# Altium project Test_Board.PrjPcb
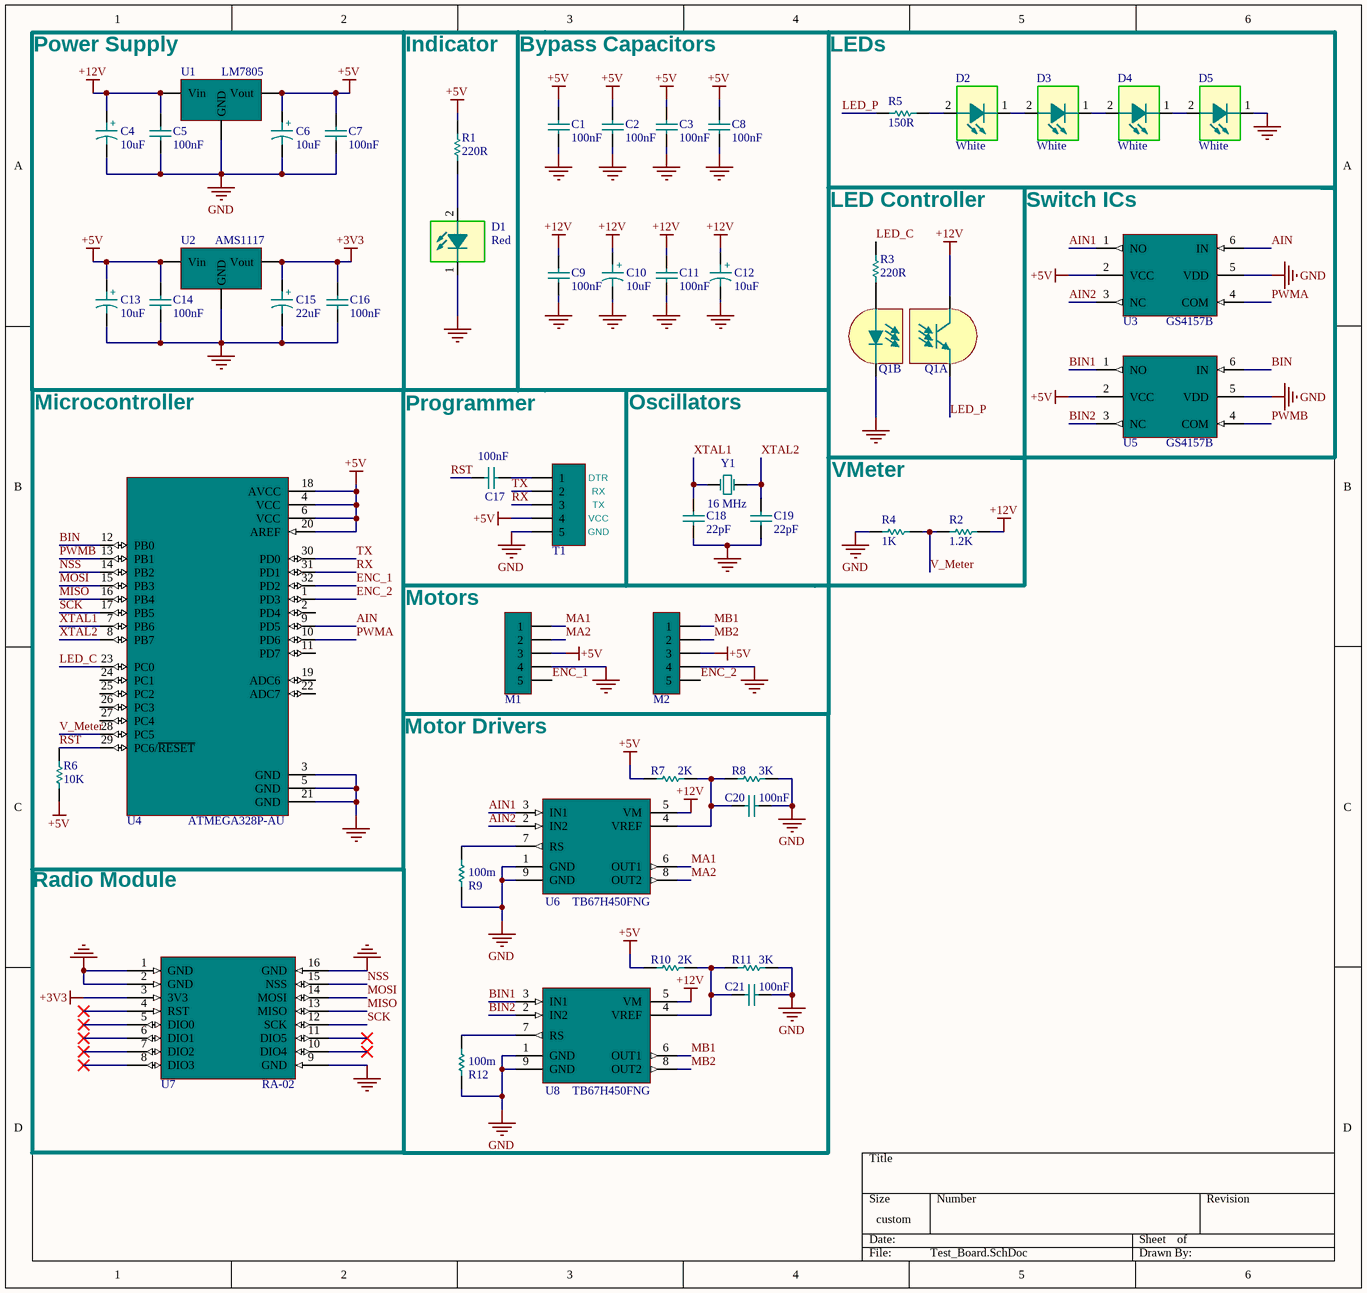
[diagram p0: Test_Board.SchDoc]
1 sheet, 51 parts. Net scope: global (net labels, ports and power ports of the same name join across sheets).
Board file: Test_Board.PcbDoc

## Sheet Test_Board.SchDoc
size 255 x 241 mm; SheetNumber: 1; SheetTotal: 1

### Parts
C1  Val-1: 100nF  [CAP 1206]  (hidden comment: Cap)
C2  Val-1: 100nF  [CAP 1206]  (hidden comment: Cap)
C3  Val-1: 100nF  [CAP 1206]  (hidden comment: Cap)
C4  Val-1: 10uF  [CAP Tantalum Size B]  (hidden comment: Cap BiPolar)
C5  Val-1: 100nF  [CAP 1206]  (hidden comment: Cap)
C6  Val-1: 10uF  [CAP Tantalum Size B]  (hidden comment: Cap BiPolar)
C7  Val-1: 100nF  [CAP 1206]  (hidden comment: Cap)
C8  Val-1: 100nF  [CAP 1206]  (hidden comment: Cap)
C9  Val-1: 100nF  [CAP 1206]  (hidden comment: Cap)
C10  Val-1: 10uF  [CAP Tantalum Size B]  (hidden comment: Cap BiPolar)
C11  Val-1: 100nF  [CAP 1206]  (hidden comment: Cap)
C12  Val-1: 10uF  [CAP Tantalum Size B]  (hidden comment: Cap BiPolar)
C13  Val-1: 10uF  [CAP Tantalum Size B]  (hidden comment: Cap BiPolar)
C14  Val-1: 100nF  [CAP 1206]  (hidden comment: Cap)
C15  Val-1: 22uF  [CAP Tantalum Size B]  (hidden comment: Cap BiPolar)
C16  Val-1: 100nF  [CAP 1206]  (hidden comment: Cap)
C17  Val-1: 100nF  [CAP 1206]  (hidden comment: Cap)
C18  Val-2: 22pF  [CAP 1206]  (hidden comment: Cap)
C19  Val-2: 22pF  [CAP 1206]  (hidden comment: Cap)
C20  Val-1: 100nF  [CAP 1206]  (hidden comment: Cap)
C21  Val-1: 100nF  [CAP 1206]  (hidden comment: Cap)
D1  Color-2: Red  [LED 1206]  (hidden comment: LED)
D2  Color-4: White  [LED 3528]  (hidden comment: LED)
D3  Color-4: White  [LED 3528]  (hidden comment: LED)
D4  Color-4: White  [LED 3528]  (hidden comment: LED)
D5  Color-4: White  [LED 3528]  (hidden comment: LED)
M1  Motor  [Motor]  (value not drawn)
M2  Motor  [Motor]  (value not drawn)
Q1  PC817  [PC817]  (value not drawn)  (parts A,B of 2)
R1  Val-3: 220R  [RES 1206]  (hidden comment: Resistor)
R2  Val-12: 1.2K  [RES 1206]  (hidden comment: Resistor)
R3  Val-3: 220R  [RES 1206]  (hidden comment: Resistor)
R4  Val-1: 1K  [RES 1206]  (hidden comment: Resistor)
R5  Val-8: 150R  [RES 1206]  (hidden comment: Resistor)
R6  Val-2: 10K  [RES 1206]  (hidden comment: Resistor)
R7  Val-11: 2K  [RES 1206]  (hidden comment: Resistor)
R8  Val-10: 3K  [RES 1206]  (hidden comment: Resistor)
R9  Val-9: 100m  [RES 1206]  (hidden comment: Resistor)
R10  Val-11: 2K  [RES 1206]  (hidden comment: Resistor)
R11  Val-10: 3K  [RES 1206]  (hidden comment: Resistor)
R12  Val-9: 100m  [RES 1206]  (hidden comment: Resistor)
T1  5 Pin Socket  [MO Header 5]  (value not drawn)
U1  LM7805  [7805 SMD]
U2  AMS1117  [AMS1117]
U3  GS4157B  [GS4157B]
U4  ATMEGA328P-AU  [ATmega328]
U5  GS4157B  [GS4157B]
U6  TB67H450FNG  [TB67H450FNG]
U7  RA-02  [RA-02]
U8  TB67H450FNG  [TB67H450FNG]
Y1  Val-2: 16 MHz  [Crystal-5032]  (hidden comment: XTAL)

### Blocks framed on the sheet
Power Supply: C4-C7 C13-C16 U1 U2

### Nets
+3V3: C15.1 C16.1 U2.2(Vout) U7.3(3V3)
+5V: C1.1 C2.1 C3.1 C6.1 C7.1 C8.1 C13.1 C14.1 M1.3 M2.3 R1.2 R6.2 R7.2 R10.2 T1.4 U1.3(Vout) U2.3(Vin) U3.2(VCC) U4.4(VCC) U4.6(VCC) U4.18(AVCC) U4.20(AREF) U5.2(VCC)
+12V: C4.1 C5.1 C9.1 C10.1 C11.1 C12.1 Q1.4(C) R2.2 U1.1(Vin) U6.5(VM) U8.5(VM)
GND: C1.2 C2.2 C3.2 C4.2 C5.2 C6.2 C7.2 C8.2 C9.2 C10.2 C11.2 C12.2 C13.2 C14.2 C15.2 C16.2 C18.1 C19.1 C20.2 C21.2 D1.1 D5.1 M1.4 M2.4 Q1.2(K) R4.1 R8.1 R9.1 R11.1 R12.1 T1.5 U1.2(GND) U2.1(GND) U3.5(VDD) U4.3(GND) U4.5(GND) U4.21(GND) U5.5(VDD) U6.1(GND) U6.9(GND) U7.1(GND) U7.2(GND) U7.9(GND) U7.16(GND) U8.1(GND) U8.9(GND)
AIN: U3.6(IN) U4.9(PD5)
AIN1: U3.1(NO) U6.3(IN1)
AIN2: U3.3(NC) U6.2(IN2)
BIN: U4.12(PB0) U5.6(IN)
BIN1: U5.1(NO) U8.3(IN1)
BIN2: U5.3(NC) U8.2(IN2)
ENC_1: M1.5 U4.32(PD2)
ENC_2: M2.5 U4.1(PD3)
LED_C: R3.2 U4.23(PC0)
LED_P: Q1.3(E) R5.2
MA1: M1.1 U6.6(OUT1)
MA2: M1.2 U6.8(OUT2)
MB1: M2.1 U8.6(OUT1)
MB2: M2.2 U8.8(OUT2)
MISO: U4.16(PB4) U7.13(MISO)
MOSI: U4.15(PB3) U7.14(MOSI)
NSS: U4.14(PB2) U7.15(NSS)
PWMA: U3.4(COM) U4.10(PD6)
PWMB: U4.13(PB1) U5.4(COM)
RST: C17.1 R6.1 U4.29(PC6/~{RESET})
RX: T1.3 U4.31(PD1)
SCK: U4.17(PB5) U7.12(SCK)
TX: T1.2 U4.30(PD0)
V_Meter: R2.1 R4.2 U4.28(PC5)
XTAL1: C18.2 U4.7(PB6) Y1.1(OSC1)
XTAL2: C19.2 U4.8(PB7) Y1.2(OSC2)
NetC17_2: C17.2 T1.1
NetC20_1: C20.1 R7.1 R8.2 U6.4(VREF)
NetC21_1: C21.1 R10.1 R11.2 U8.4(VREF)
NetD1_2: D1.2 R1.1
NetD2_1: D2.1 D3.2
NetD2_2: D2.2 R5.1
NetD3_1: D3.1 D4.2
NetD4_1: D4.1 D5.2
NetQ1_1: Q1.1(A) R3.1
NetR9_2: R9.2 U6.7(RS)
NetR12_2: R12.2 U8.7(RS)

Not connected (* = marked no-connect by the designer): U4 2(PD4) 11(PD7) 19(ADC6) 22(ADC7) 24(PC1) 25(PC2) 26(PC3) 27(PC4); U7 4(RST)* 5(DIO0)* 6(DIO1)* 7(DIO2)* 8(DIO3)* 10(DIO4)* 11(DIO5)*

### Notes on the sheet
- Indicator
- Bypass Capacitors
- LEDs
- (near R3) LED Controller
- (near U3) Switch ICs
- Microcontroller
- Programmer
- Oscillators
- (near T1) DTR
- (near T1) RX
- (near T1) TX
- VMeter
- (near T1) VCC
- (near T1) GND
- Motors
- (near M1) Motor Drivers
- Radio Module
- (in symbol Cap BiPolar) +

### Library data of the parts
C1 = Cap: AVCC Cap; Val-2: 22pF; Val-3: 22uF
C2 C3 = Cap: VCC Cap; Val-2: 22pF; Val-3: 22uF
C4 C6 = Cap BiPolar: 5V Regulator Cap 10uF 25V; Val-2: 100uF; Val-3: 1000uF
C5 C7 = Cap: 5V Regulator Cap 100nF; Val-2: 22pF; Val-3: 22uF
C8 = Cap: AREF Cap; Val-2: 22pF; Val-3: 22uF
C9 C11 = Cap: Motor Power Cap; Val-2: 22pF; Val-3: 22uF
C10 C12 = Cap BiPolar: Motor Power Cap; Val-2: 100uF; Val-3: 1000uF
C13 C15 = Cap BiPolar: 3.3V Regulator Cap; Val-2: 100uF; Val-3: 1000uF
C14 C16 = Cap: 3.3V Regulator Cap; Val-2: 22pF; Val-3: 22uF
C17 = Cap: Programmer Cap; Val-2: 22pF; Val-3: 22uF
C18 C19 = Cap: 1206 Capacitor; Val-1: 100nF; Val-3: 22uF
C20 C21 = Cap: Motor Driver Cap; Val-2: 22pF; Val-3: 22uF
D1 = LED: Color-1: Blue; Color-3: Green; Color-4: White
D2-D5 = LED: Color-1: Blue; Color-2: Red; Color-3: Green
Q1 = PC817: DIP 4pin General Purpose  Photocoupler
R1 R3 = Resistor: Val-1: 1K; Val-2: 10K
R2 = Resistor: Val-1: 1K; Val-2: 10K; Val-3: 220R; Val-4: 100K; Val-5: 24.9K; Val-6: 8.2K; Val-7: 43K; Val-8: 150R; Val-9: 100m; Val-10: 6K; Val-11: 4K
R4 = Resistor: Val-2: 10K; Val-3: 220R; Val-4: 100K; Val-5: 24.9K; Val-6: 8.2K; Val-7: 43K; Val-8: 150R; Val-9: 100m; Val-10: 6K; Val-11: 4K; Val-12: 1.2K
R5 = Resistor: Val-1: 1K; Val-2: 10K; Val-3: 220R; Val-4: 100K; Val-5: 24.9K; Val-6: 8.2K; Val-7: 43K
R6 = Resistor: Val-1: 1K; Val-3: 220R
R7 R10 = Resistor: Val-1: 1K; Val-2: 10K; Val-3: 220R; Val-4: 100K; Val-5: 24.9K; Val-6: 8.2K; Val-7: 43K; Val-8: 150R; Val-9: 100m; Val-10: 6K
R8 R11 = Resistor: Val-1: 1K; Val-2: 10K; Val-3: 220R; Val-4: 100K; Val-5: 24.9K; Val-6: 8.2K; Val-7: 43K; Val-8: 150R; Val-9: 100m; Val-11: 4K
R9 R12 = Resistor: Val-1: 1K; Val-2: 10K; Val-3: 220R; Val-4: 100K; Val-5: 24.9K; Val-6: 8.2K; Val-7: 43K; Val-8: 150R; Val-10: 6K; Val-11: 4K
U1 = LM7805: 5V Regulator; pin to pad: 2>4
U2 = AMS1117: 3V3 Regulator
U4 = ATMEGA328P-AU: ATmega 328 Microcontroller
U6 U8 = TB67H450FNG: Motor Driver
U7 = RA-02: LoRa RA-02
Y1 = XTAL: XTAL Crystal; Val-1: 12 MHz